# Altium schematic sheet Smart Watch Schematic.SchDoc
size A4
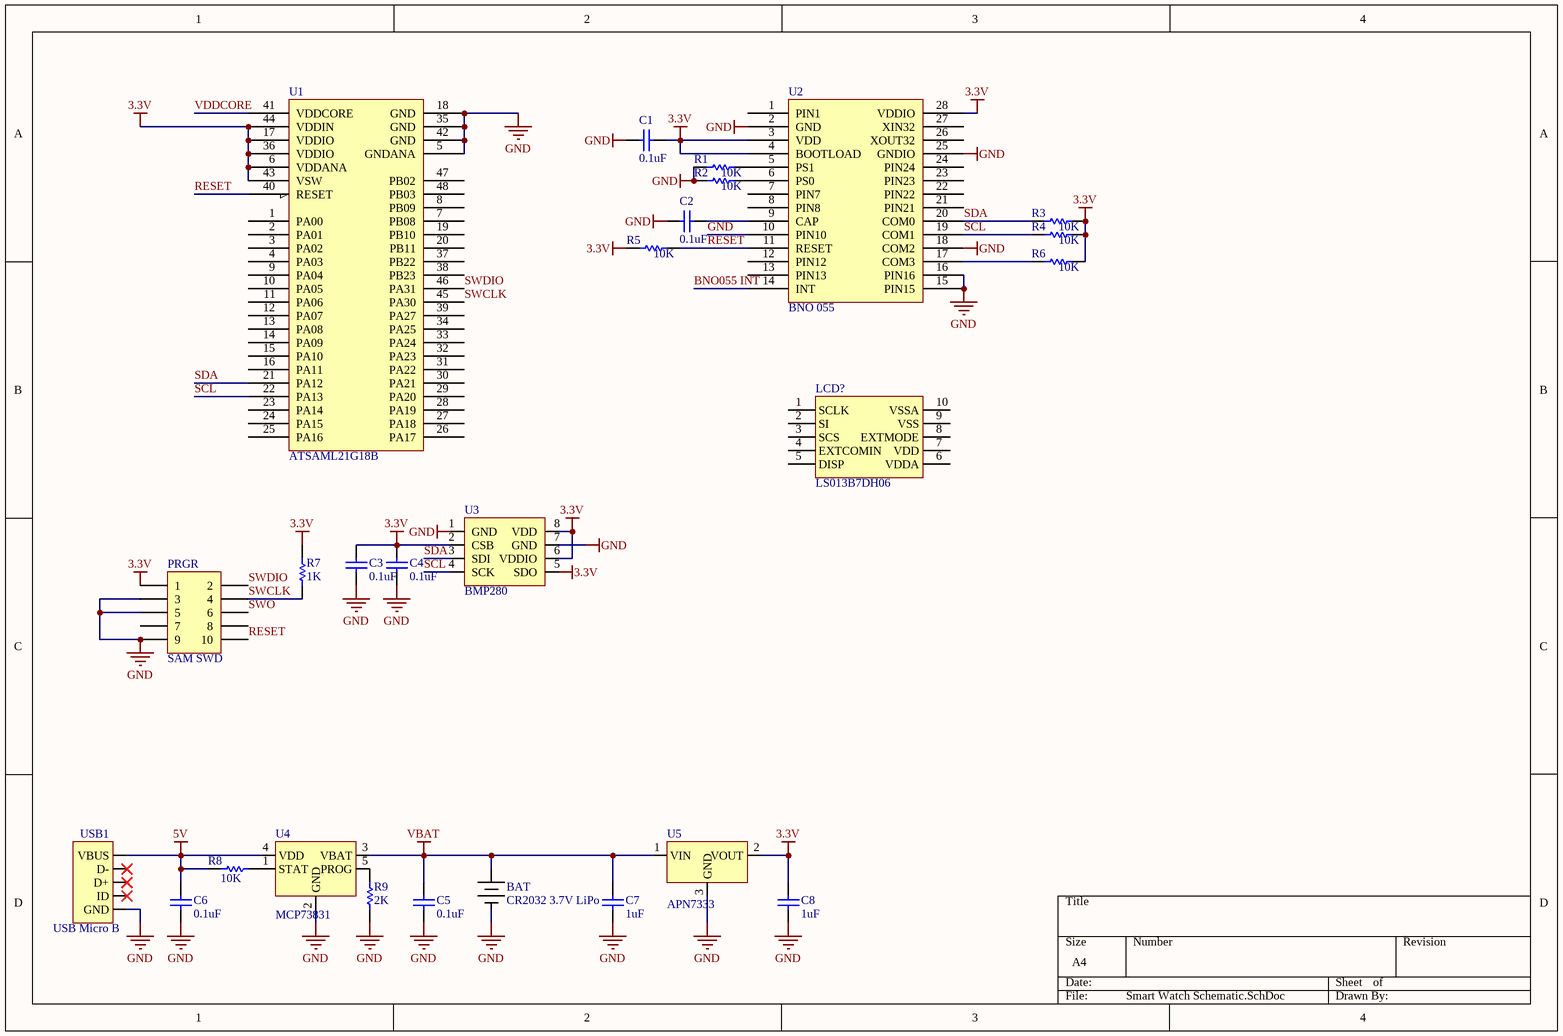
[diagram p0: Smart Watch Schematic.SchDoc]

## Parts
BAT  CR2032 3.7V LiPo  [Keystone 3002 CR2032 Battery Holder]
C1  0.1uF  [_0402]
C2  0.1uF  [_0402]
C3  0.1uF  [_0402]
C4  0.1uF  [_0402]
C5  0.1uF  [_0603]
C6  0.1uF  [_0603]
C7  1uF  [_0603]
C8  1uF  [_0603]
LCD?  LS013B7DH06
PRGR  SAM SWD  [HDR2X5]
R1  10K  [_0402]
R2  10K  [_0402]
R3  10K  [_0402]
R4  10K  [_0402]
R5  10K  [_0402]
R6  10K  [_0402]
R7  1K  [_0402]
R8  10K  [_0402]
R9  2K  [_0402]
U1  ATSAML21G18B  [_QFP48]
U2  BNO 055  [BNO055]
U3  BMP280  [BMP280]
U4  MCP73831  [SOT23-5]
U5  APN7333  [SOT23-3]
USB1  USB Micro B  [USB Micro B Connector]  (value not drawn)

## Nets
3.3V: C1.2 C3.2 C4.2 C8.2 PRGR.1 R3.2 R4.2 R5.1 R6.2 R7.2 U1.6(VDDANA) U1.17(VDDIO) U1.36(VDDIO) U1.43(VSW) U1.44(VDDIN) U2.3(VDD) U2.4(BOOTLOAD) U2.28(VDDIO) U3.2(CSB) U3.5(SDO) U3.6(VDDIO) U3.8(VDD) U5.2(VOUT)
5V: C6.2 R8.2 U4.4(VDD) USB1.VBUS
GND: BAT.2(-) C1.1 C2.1 C3.1 C4.1 C5.1 C6.1 C7.1 C8.1 PRGR.3 PRGR.5 PRGR.9 R1.1 R2.1 R9.2 U1.5(GNDANA) U1.18(GND) U1.35(GND) U1.42(GND) U2.2(GND) U2.10(PIN10) U2.15(PIN15) U2.16(PIN16) U2.18(COM2) U2.25(GNDIO) U3.1(GND) U3.7(GND) U4.2(GND) U5.3(GND) USB1.GND
VBAT: BAT.1(+) C5.2 C7.2 U4.3(VBAT) U5.1(VIN)
BNO055 INT: U2.14(INT)
RESET: PRGR.10 R5.2 U1.40(RESET) U2.11(RESET)
SCL: R4.1 U1.22(PA13) U2.19(COM1) U3.4(SCK)
SDA: R3.1 U1.21(PA12) U2.20(COM0) U3.3(SDI)
SWCLK: PRGR.4 R7.1 U1.45(PA30)
SWDIO: PRGR.2 U1.46(PA31)
SWO: PRGR.6
VDDCORE: U1.41(VDDCORE)
NetC2_2: C2.2 U2.9(CAP)
NetR1_2: R1.2 U2.5(PS1)
NetR2_2: R2.2 U2.6(PS0)
NetR6_1: R6.1 U2.17(COM3)
NetR8_1: R8.1 U4.1(STAT)
NetR9_1: R9.1 U4.5(PROG)

Not connected (* = marked no-connect by the designer): LCD? 1(SCLK) 2(SI) 3(SCS) 4(EXTCOMIN) 5(DISP) 6(VDDA) 7(VDD) 8(EXTMODE) 9(VSS) 10(VSSA); PRGR 7 8; U1 1(PA00) 2(PA01) 3(PA02) 4(PA03) 7(PB08) 8(PB09) 9(PA04) 10(PA05) 11(PA06) 12(PA07) 13(PA08) 14(PA09) 15(PA10) 16(PA11) 19(PB10) 20(PB11) 23(PA14) 24(PA15) 25(PA16) 26(PA17) 27(PA18) 28(PA19) 29(PA20) 30(PA21) 31(PA22) 32(PA23) 33(PA24) 34(PA25) 37(PB22) 38(PB23) 39(PA27) 47(PB02) 48(PB03); U2 1(PIN1) 7(PIN7) 8(PIN8) 12(PIN12) 13(PIN13) 21(PIN21) 22(PIN22) 23(PIN23) 24(PIN24) 26(XOUT32) 27(XIN32); USB1 D+* D-* ID*

## Library data of the parts
BAT = Keystone 3002 CR2032 Battery Holder
C1-C6 = Cap: Capacitor; Published: 8-Jun-2000; LatestRevisionDate: 17-Jul-2002; LatestRevisionNote: Re-released for DXP Platform.; PackageReference: RAD-0.3; Publisher: Altium Limited; PackageDescription: Radial Cap, Thru-Hole; 2 Leads; 0.3 in Pin Spacing; Value: 0.1uF
C7 C8 = Cap: Capacitor; Value: 0.1uF; Published: 8-Jun-2000; LatestRevisionDate: 17-Jul-2002; LatestRevisionNote: Re-released for DXP Platform.; PackageReference: RAD-0.3; Publisher: Altium Limited; PackageDescription: Radial Cap, Thru-Hole; 2 Leads; 0.3 in Pin Spacing
LCD? = LS013B7DH06 Colour Memory LCD
PRGR = Header 5X2: Header, 5-Pin, Dual row; LatestRevisionDate: 17-Jul-2002; LatestRevisionNote: Re-released for DXP Platform.; Publisher: Altium Limited
R1-R7 = Res1: Resistor; Published: 8-Jun-2000; LatestRevisionDate: 17-Jul-2002; LatestRevisionNote: Re-released for DXP Platform.; PackageReference: AXIAL-0.3; Publisher: Altium Limited; PackageDescription: Axial Device, Thru-Hole; 2 Leads; 0.3 in Pin Spacing
  R1-R6: Value: 10K
  R7: Value: 1K
R8 R9 = Res1: Resistor; Value: 1K; Published: 8-Jun-2000; LatestRevisionDate: 17-Jul-2002; LatestRevisionNote: Re-released for DXP Platform.; PackageReference: AXIAL-0.3; Publisher: Altium Limited; PackageDescription: Axial Device, Thru-Hole; 2 Leads; 0.3 in Pin Spacing
U5 = AP7333 3.3V 300mA Regulator
USB1 = USB Micro B Connector